# EAGLE design Becca Sap Flow Power Board (EAGLE 9.6.2)
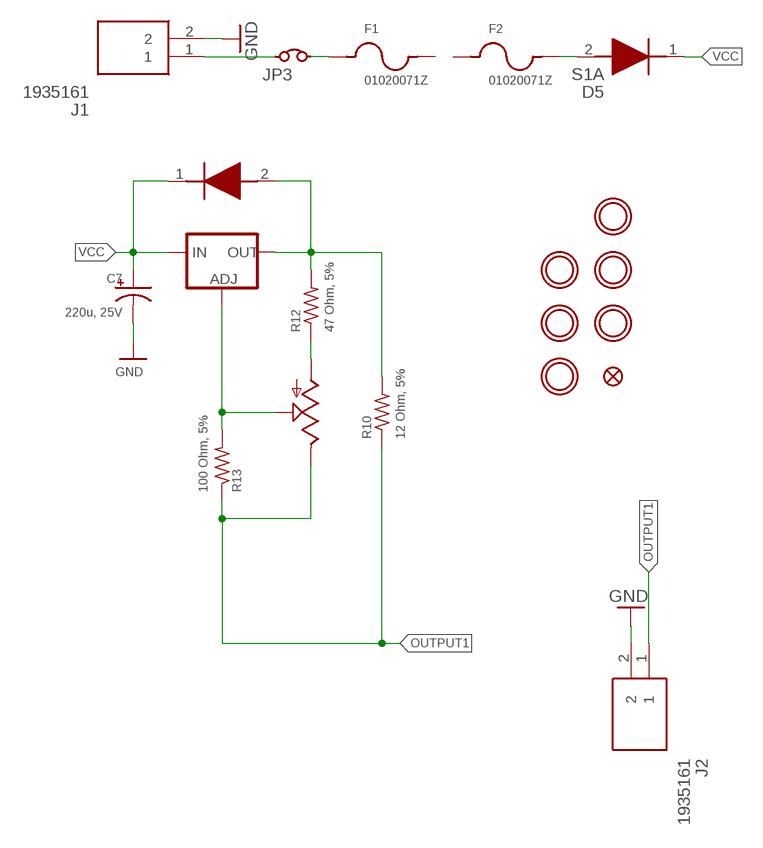
[diagram p0: schematic, sheet 1]

## Parts
C7  220u, 25V  CPOL-USC  [PANASONIC_C]
D5  S1A  [DIOM5027X250N]
D6  S1A  [DIOM5027X250N]
F1  01020071Z  [01020071Z]
F2  01020071Z  [01020071Z]
FID2  FIDUCIAL_1MM  [FIDUCIAL_1MM]
J1  1935161  [1935161]
J2  1935161  [1935161]
JP3  JUMPER  [HDR2X1]
R10  12 Ohm, 5%  R-US_R0805  [R0805]
R12  47 Ohm, 5%  R-US_R0805  [R0805]
R13  100 Ohm, 5%  R-US_R0805  [R0805]
U1  V_REG_317SMD  [SOT223]
U$1  MOUNTINGHOLE2.5  [MOUNTINGHOLE_2.5_PLATED]
U$2  MOUNTINGHOLE2.5  [MOUNTINGHOLE_2.5_PLATED]
U$3  MOUNTINGHOLE2.5  [MOUNTINGHOLE_2.5_PLATED]
U$4  MOUNTINGHOLE2.5  [MOUNTINGHOLE_2.5_PLATED]
U$5  MOUNTINGHOLE2.5  [MOUNTINGHOLE_2.5_PLATED]
U$11  MOUNTINGHOLE2.5  [MOUNTINGHOLE_2.5_PLATED]
VR1  3296W-1-102RLF  [3296W1102RLF]

## Nets
GND: C7.- J1.2 J2.2
N$1: J1.1 JP3.1
N$3: F1.1 JP3.2
N$5: D5.2(A) F2.2
N$12: D6.2(A) R10.2 R12.2 U1.2(OUT)
N$14: R13.2 U1.1(ADJ) VR1.2(S)
N$15: R12.1 VR1.1(A)
OUTPUT1: J2.1 R10.1 R13.1 VR1.3(E)
VCC: C7.+ D5.1(K) D6.1(K) U1.3(IN)
Unconnected: F1.2 F2.1

## Library data of the parts
C7 = rcl:CPOL-US: POLARIZED CAPACITOR, American symbol; SPICEPREFIX: C
D5 D6 = S1A:S1A: Rectifier Diode Switching 50V 1A 1500ns 2-Pin SMA T/R Source: Datasheet <https://diotec.com/request/datasheet/s1a.pdf>; DESCRIPTION: Rectifier Diode Switching 50V 1A 1500ns 2-Pin SMA T/R; HEIGHT: 2.5mm; MANUFACTURER_NAME: Diotec; MANUFACTURER_PART_NUMBER: S1A; MOUSER_PART_NUMBER: 637-S1A; MOUSER_PRICE-STOCK: https://www.mouser.co.uk/ProductDetail/Diotec-Semiconductor/S1A?qs=OlC7AqGiEDlqVjQP70PTqA%3D%3D
F1 F2 = Fuse Holder:01020071Z: FUSE CLIP CARTRIDGE 250V 15A PCB Manufacturer's datasheet <https://www.littelfuse.com/~/media/electronics/datasheets/fuse_clips/littelfuse_fuse_clip_102_122_datasheet.pdf.pdf>; CREATED_BY: PCBLayout.com; DIGIKEY_PN: F3781-ND; MANUFACTURER: Littelfuse Inc.; MPN: 01020071Z
FID2 = microbuilder:FIDUCIAL: Fiducial Alignment Points Various fiducial points for machine vision alignment.; BOM: EXCLUDE
J1 J2 = Dual Mono Amp Library:1935161: Phoenix Contact COMBICON PT PCB Terminal Block, 2 Way/Pole, Screw Terminals, 26 14 AWG Through Hole, Nylon Source: Datasheet <https://datasheet.datasheetarchive.com/originals/distributors/SFDatasheet-2/sf-00057459.pdf>; DESCRIPTION: Phoenix Contact COMBICON PT PCB Terminal Block, 2 Way/Pole, Screw Terminals, 26 14 AWG Through Hole, Nylon; HEIGHT: 11.55mm; MANUFACTURER_NAME: Phoenix Contact; MANUFACTURER_PART_NUMBER: 1935161; MOUSER_PART_NUMBER: 651-1935161; MOUSER_PRICE-STOCK: https://www.mouser.co.uk/ProductDetail/Phoenix-Contact/1935161?qs=W3wJikR1%252BS6eKzfFl8Rbew%3D%3D
JP3 = 6P1_EVB:JUMPER: Wire jumper .1" C
R10 R12 R13 = rcl:R-US_: RESISTOR, American symbol; SPICEPREFIX: R
U1 = SparkFun-IC-Power:V_REG_317: Voltage Regulator Standard LM317 adjustable voltage regulator. AOI (Adjust Output Input). Google 'LM317 Calculator' for easy to use app to get the two resistor values needed. 240/720 for 5V output. 240/390 for 3.3V output. Spark Fun Electronics SKU : COM-00527
U$1-U$5 U$11 = microbuilder:MOUNTINGHOLE: Mounting Hole For #2 screws (0.086"/2.18mm width, 0.094"/2.4mm hole) use 2.5mm; BOM: EXCLUDE
VR1 = 3296W-1-102RLF:3296W-1-102RLF: 1 kOhms 0.5W, 1/2W PC Pins Through Hole Trimmer Potentiometer Cermet 25.0 Turn Top Adjustment Source: Datasheet <https://www.bourns.com/docs/Product-Datasheets/3296.pdf>; DESCRIPTION: 1 kOhms 0.5W, 1/2W PC Pins Through Hole Trimmer Potentiometer Cermet 25.0 Turn Top Adjustment; HEIGHT: 11.8mm; MANUFACTURER_NAME: Bourns; MANUFACTURER_PART_NUMBER: 3296W-1-102RLF; MOUSER_PART_NUMBER: 652-3296W-1-102RLF; MOUSER_PRICE-STOCK: https://www.mouser.co.uk/ProductDetail/Bourns/3296W-1-102RLF?qs=oM%2FE6%2FUWOpR5bwX1MfrWeA%3D%3D

## Net classes
1 highpower: width 0.305 mm, drill 0.483 mm

## Board
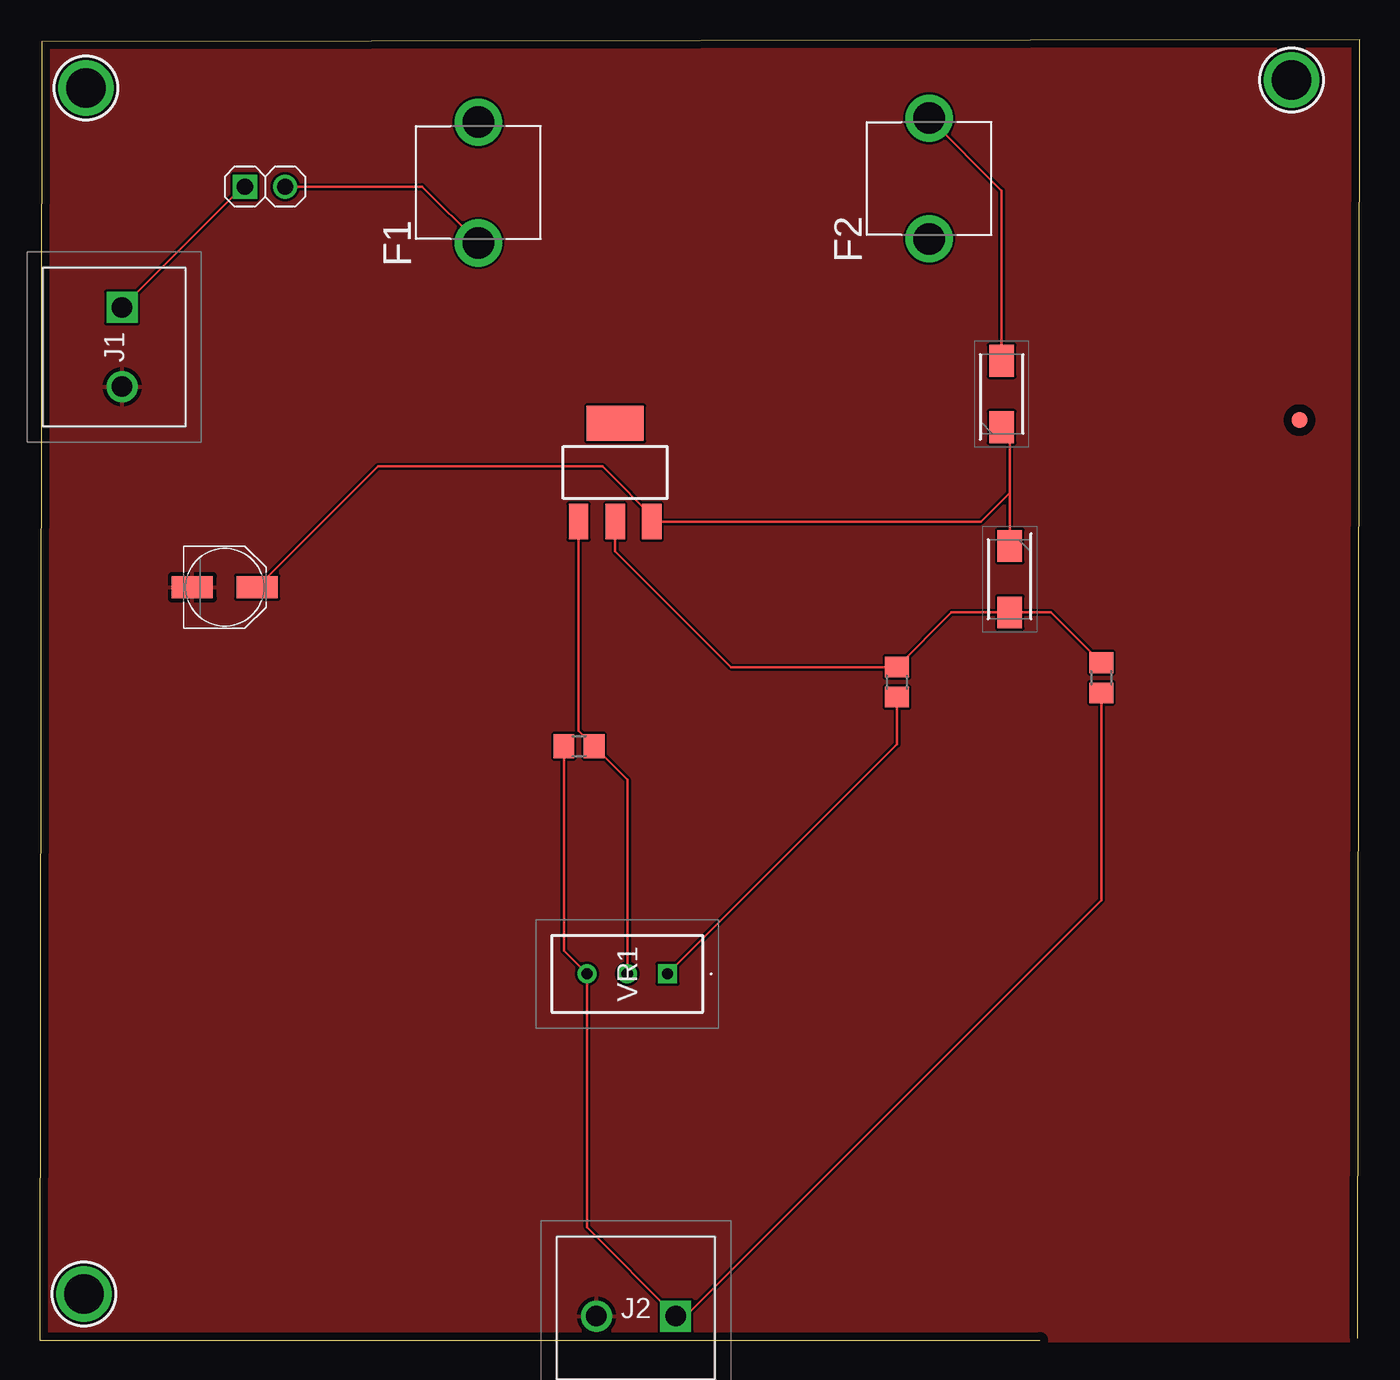
[diagram p1: board, top side]
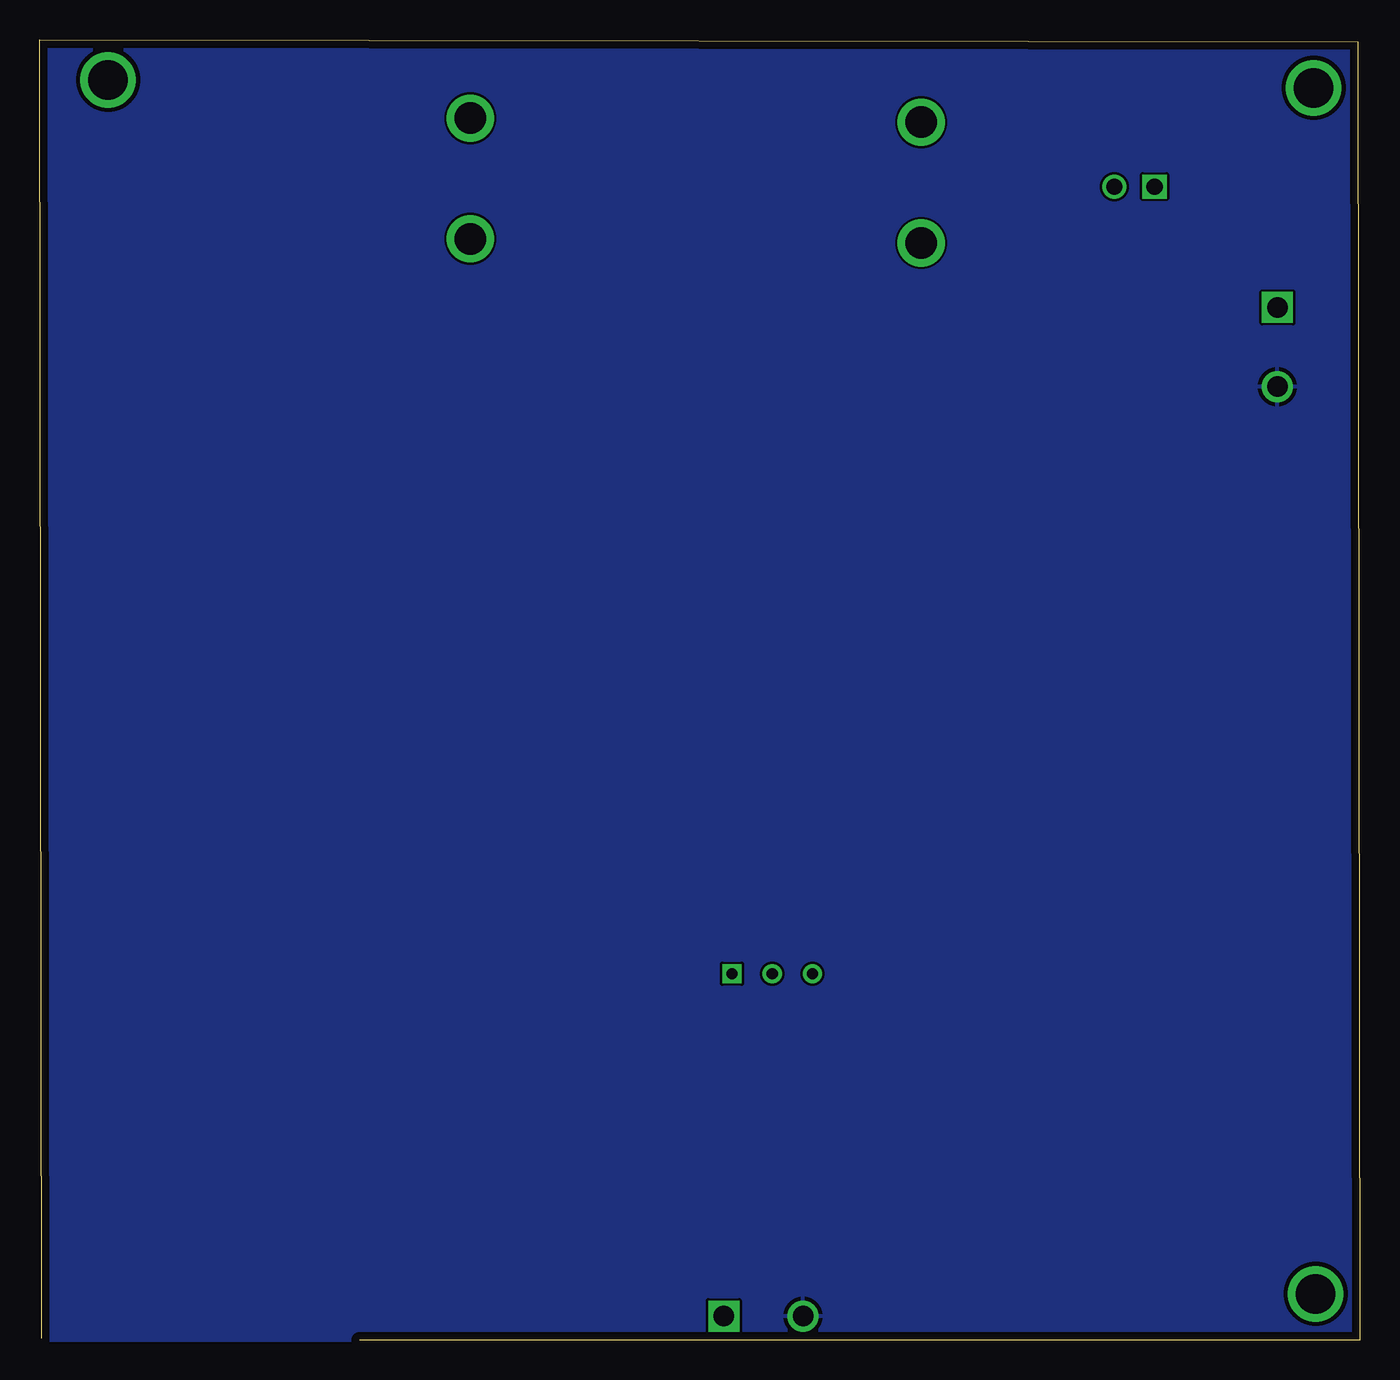
[diagram p2: board, bottom side, seen from below]

Size 83.31 x 82.04 mm. Coordinates in mm from the lower left corner, seen from the top.
Outline: 63.12,0 0,0 0.13,81.92 83.31,82.04 83.19,0.13
Copper layers (1*16): Top 0.035mm / dielectric 1.6mm / Bottom 0.035mm
Design rules "Elecrow_2-layer_PCB_eagle_rule": minimum track width 6mil, minimum drill 12mil, track to track 6mil, track to pad 6mil, pad to pad 6mil, via to via 8mil, smd to smd 0mil, copper to edge 20mil, drill to drill 10mil, minimum pad ring 6mil, minimum via ring 6mil, stop-mask expansion 0mil, vias tented up to drill 100mil, thermal gap 10mil

### Footprints (pad centres in the part's own frame; a part is rotated, then mirrored left to right if it is on the bottom)
PANASONIC_C = smd 2.6 x 1.4: + 2.05,0; - -2.05,0
DIOM5027X250N = smd 2 x 1.55: 1 -2.1,0; 2 2.1,0
01020071Z = drill 1.98: 1 -3.81,0; 2 3.81,0
FIDUCIAL_1MM = smd 1 x 1: 1 0,0
1935161 = drill 1.3 pad 1.95 square: 1 0,0 | drill 1.3 pad 1.95: 2 5,0
HDR2X1 = drill 1.016 square: 1 0,0 | drill 1.016: 2 2.54,0
R0805 = smd 1.3 x 1.5: 1 -0.95,0; 2 0.95,0
SOT223 = smd 1.219 x 2.235: 1 -2.311,-3.099; 2 0,-3.099; 3 2.311,-3.099 | smd 3.6 x 2.2: 4 0,3.099
MOUNTINGHOLE_2.5_PLATED = drill 2.5 pad 3.2: P$1 0,0
3296W1102RLF = drill 0.71 pad 1.217 square: 1 0,0 | drill 0.71 pad 1.217: 2 0,2.54; 3 0,5.08

### Placement (x,y rotation side)
C7  11.68,47.5 0 top
D5  60.71,59.69 90 top
D6  61.21,48.01 270 top
F1  27.69,73.03 90 top
F2  56.13,73.28 90 top
FID2  79.5,58.04 0 top
J1  5.21,65.15 270 top
J2  40.13,1.52 180 top
JP3  12.95,72.77 0 top
R10  67,41.78 90 top
R12  54.1,41.52 90 top
R13  34.04,37.47 0 top
U1  36.32,54.74 0 top
U$1  -21.34,-24.64 0 top  (outside the outline)
U$2  -21.34,-28.96 0 top  (outside the outline)
U$3  2.79,2.92 0 top
U$4  2.92,78.99 0 top
U$5  -21.34,-33.27 0 top  (outside the outline)
U$11  78.99,79.5 0 top
VR1  39.62,23.11 90 top

### Tracks (layer width: path | path; a pad name or v marks a point on that pad's centre or on a via)
GND
  pour Bottom (rank 3): 0.13,0 84.96,0 84.96,81.92 0.13,81.92
  pour Top (rank 3): 0.13,0 85.98,0 85.98,81.92 0.13,81.92
N$1
  Top 0.152: J1.1 12.83,72.77 JP3.1
N$3
  Top 0.152: JP3.2 24.13,72.77 F1.1
N$5
  Top 0.152: F2.2 60.71,72.52 D5.2
N$12
  Top 0.152: U1.2 36.32,49.78 43.64,42.47 R12.2 57.54,45.91 D6.2 63.82,45.91 R10.2
N$14
  Top 0.152: VR1.2 37.08,35.37 R13.2 34.01,38.44 U1.1
N$15
  Top 0.152: R12.1 54.1,37.59 VR1.1
OUTPUT1
  Top 0.152: R10.1 67,27.75 40.77,1.52 J2.1 34.54,7.11 VR1.3 33.09,24.57 R13.1
VCC
  Top 0.152: D6.1 61.21,53.47 | 61.21,53.47 61.21,57.08 D5.1 | U1.3 38.99,51.64 | 38.99,51.64 59.38,51.64 61.21,53.47 | C7.+ 21.35,55.12 35.51,55.12 38.99,51.64